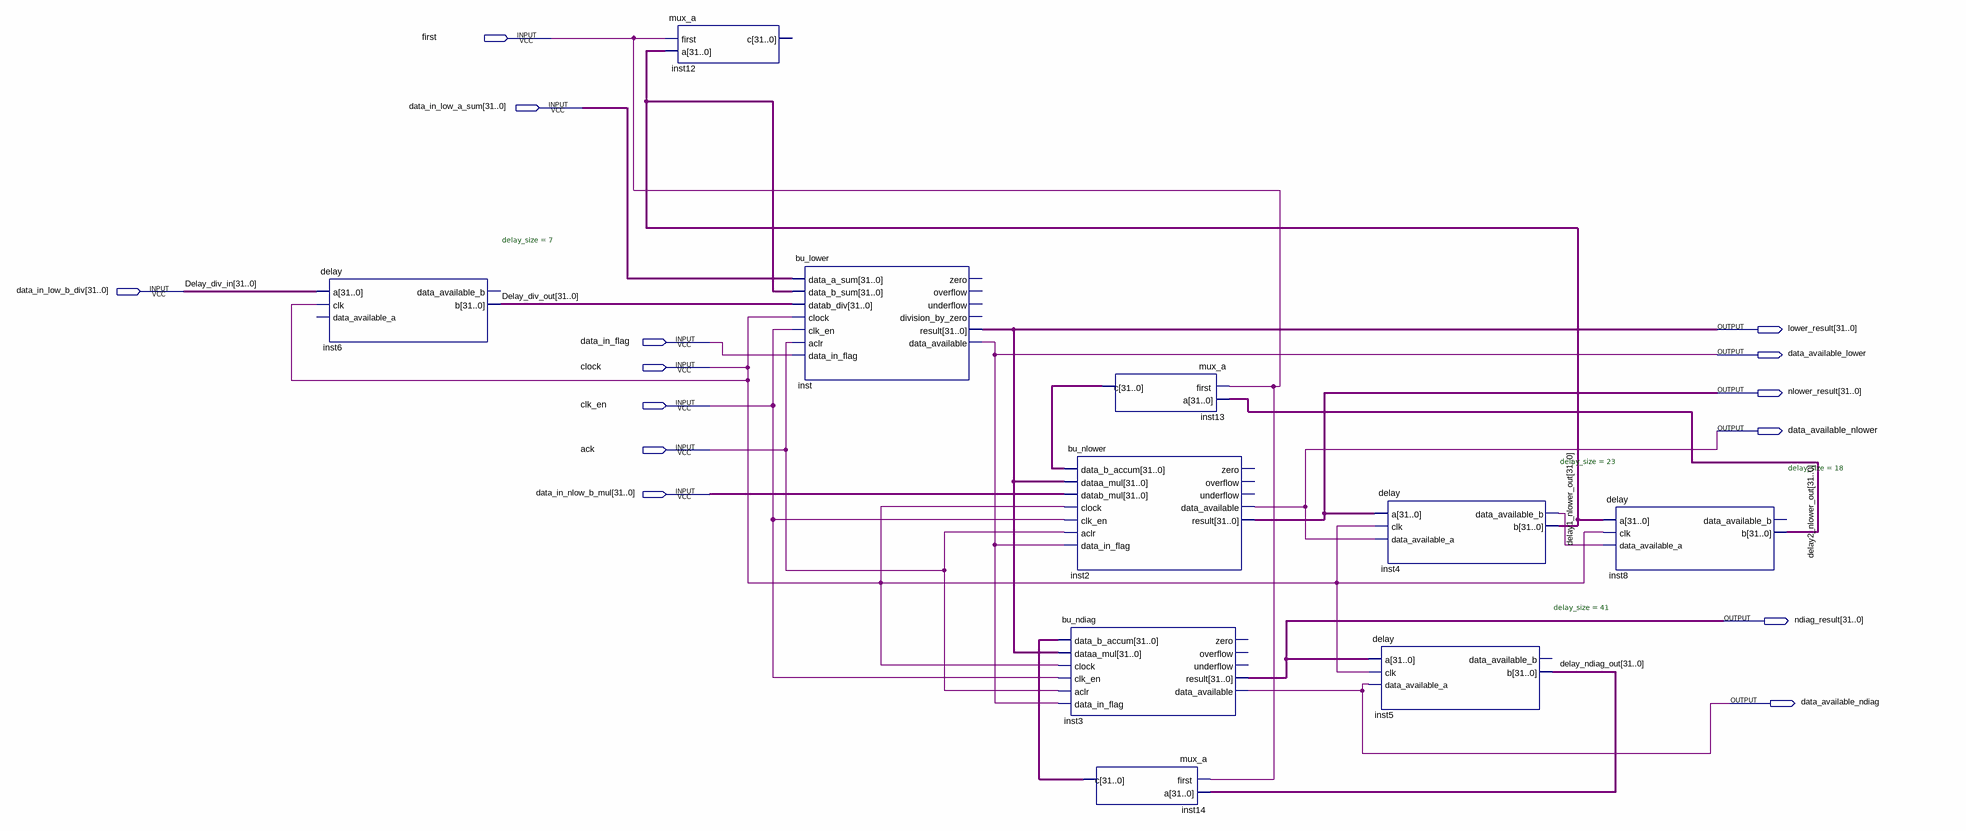
[diagram p0: schematic sheet]
// Quartus schematic bu_ukf.bdf as structural Verilog: 10 symbols, 14 pins
module bu_ukf (
  input  first,
  input  [31:0] data_in_low_a_sum,
  input  [31:0] data_in_low_b_div,
  input  data_in_flag,
  input  clock,
  input  clk_en,
  input  ack,
  input  [31:0] data_in_nlow_b_mul,
  output [31:0] lower_result,
  output data_available_lower,
  output [31:0] nlower_result,
  output data_available_nlower,
  output [31:0] ndiag_result,
  output data_available_ndiag
);

  wire inst4_data_available_b;
  wire [31:0] delay1_nlower_out, delay2_nlower_out, Delay_div_out, delay_ndiag_out, inst13_c, inst14_c;

  delay #(.delay_size(7)) inst6 (
    .a(data_in_low_b_div), .clk(clock), .b(Delay_div_out));  // open: data_available_a, data_available_b
  mux_a inst12 (.first(first), .a(delay1_nlower_out));  // open: c
  bu_lower inst (
    .data_a_sum(data_in_low_a_sum), .data_b_sum(delay1_nlower_out), .datab_div(Delay_div_out), .clock(clock),
    .clk_en(clk_en), .aclr(ack), .data_in_flag(data_in_flag), .result(lower_result),
    .data_available(data_available_lower));  // open: zero, overflow, underflow, division_by_zero
  bu_nlower inst2 (
    .data_b_accum(inst13_c), .dataa_mul(lower_result), .datab_mul(data_in_nlow_b_mul), .clock(clock),
    .clk_en(clk_en), .aclr(ack), .data_in_flag(data_available_lower), .data_available(data_available_nlower),
    .result(nlower_result));  // open: zero, overflow, underflow
  bu_ndiag inst3 (
    .data_b_accum(inst14_c), .dataa_mul(lower_result), .clock(clock), .clk_en(clk_en), .aclr(ack),
    .data_in_flag(data_available_lower), .result(ndiag_result), .data_available(data_available_ndiag));  // open: zero, overflow, underflow
  mux_a inst14 (.first(first), .a(delay_ndiag_out), .c(inst14_c));
  mux_a inst13 (.first(first), .a(delay2_nlower_out), .c(inst13_c));
  delay #(.delay_size(23)) inst4 (
    .a(nlower_result), .clk(clock), .data_available_a(data_available_nlower),
    .data_available_b(inst4_data_available_b), .b(delay1_nlower_out));
  delay #(.delay_size(41)) inst5 (
    .a(ndiag_result), .clk(clock), .data_available_a(data_available_ndiag), .b(delay_ndiag_out));  // open: data_available_b
  delay #(.delay_size(18)) inst8 (
    .a(delay1_nlower_out), .clk(clock), .data_available_a(inst4_data_available_b), .b(delay2_nlower_out));  // open: data_available_b

  // Other names for the same wires on the sheet: Delay_div_in[31:0] = data_in_low_b_div
endmodule
